# EasyEDA schematic 主板.json
TITLE: Sheet_1; REV: 1.0; Date: 2022-08-09; Sheet: 1/1; Drawn By: ThunderStorm0411; Company: Your Company
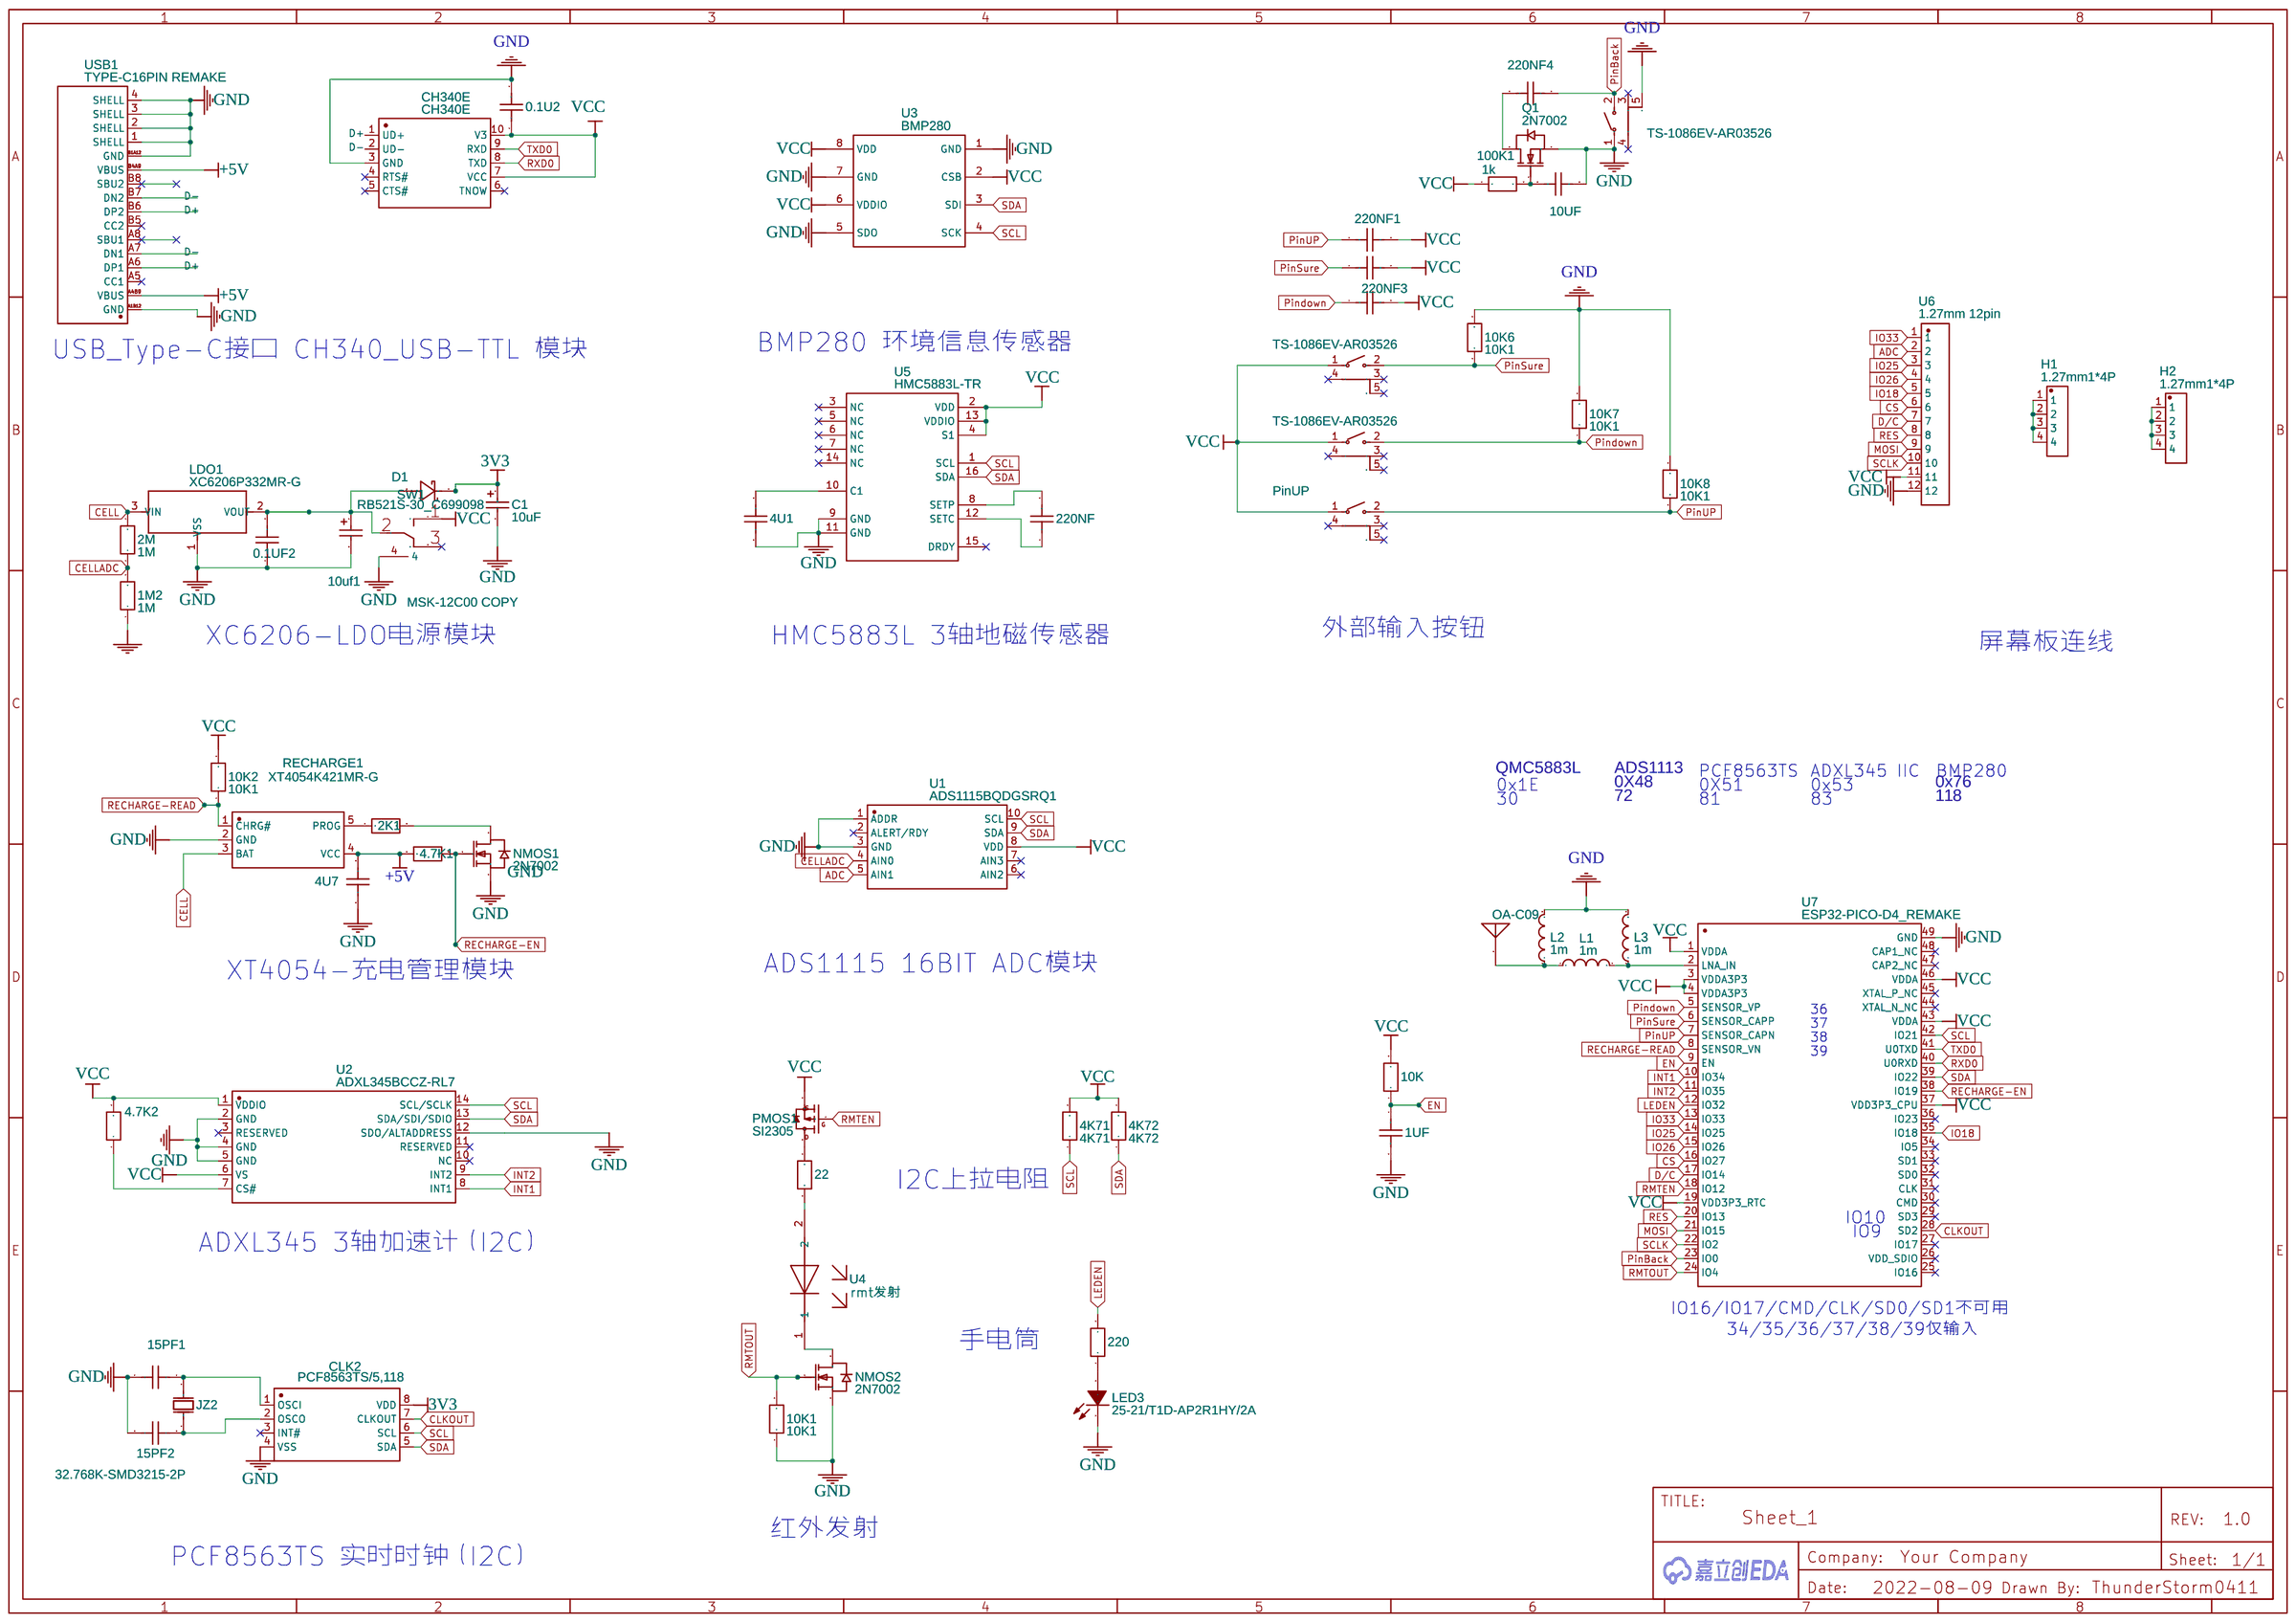
[diagram p0: schematic sheet]

## Parts
0.1U2  0.1u  [C0603]
0.1UF2  0.1u  [C0603]
1  OA-C09  [OA-C09]
1M2  1M  [R0603]
1UF  1uF  [C0603]
2K1  2k1  [R0603]
2M  1M  [R0603]
4.7K1  4.7K  [R0603]
4.7K2  4.7K  [R0603]
4K71  4K71  [R0603]
4K72  4K72  [R0603]
4U1  0.1u  [C0603]
4U7  4.7uf  [C0603]
10K  10kΩ  [R0603]
10K1  10K1  [R0603]
10K2  10K1  [R0603]
10K6  10K1  [R0603]
10K7  10K1  [R0603]
10K8  10K1  [R0603]
10UF  0.1u  [C0603]
15PF1  15PF  [C0603]
15PF2  15PF2  [C0603]
22  1001  [R0603]
100K1  1k  [R0603]
220  10K2  [R0603]
220NF  0.1u  [C0603]
220NF1  0.1u  [C0603]
220NF2  0.1u  [C0603]
220NF3  0.1u  [C0603]
220NF4  0.1u  [C0603]
BACK1  TS-1086EV-AR03526  [SW-SMD_TS-1086EV-AR03526]
C1  10uF  [CAP-SMD_L3.2-W1.6-RD-C7171]
C5  10uf1  [CAP-SMD_L3.2-W1.6-RD-C7171]
CH340E  CH340E  [MSOP-10_L3.0-W3.0-P0.50-LS5.0-BL]
CLK2  PCF8563TS/5,118  [TSSOP-8_L3.0-W3.0-P0.65-LS4.9-BL]
D1  RB521S-30_C699098  [SOD-523_L1.2-W0.8-LS1.6-RD]
DOWN1  TS-1086EV-AR03526  [SW-SMD_TS-1086EV-AR03526]
H1  1.27mm1*4P  [1.27MM1*4P]
H2  1.27mm1*4P  [1.27MM1*4P]
JZ2  32.768K-SMD3215-2P  [CRYSTAL-SMD_L3.2-W1.5-2]
L1  1m  [L0603]
L2  1m  [L0603]
L3  1m  [L0603]
LDO1  XC6206P332MR-G  [SEEED-SOT-23]
LED3  25-21/T1D-AP2R1HY/2A  [LED1206-R-RD]
NMOS1  2N7002  [SOT-23_L2.9-W1.3-P0.95-LS2.4-BR]
NMOS2  2N7002  [SOT-23_L2.9-W1.3-P0.95-LS2.4-BR]
PMOS1  SI2305  [SOT-23-3_L2.9-W1.3-P1.90-LS2.4-BR]
Q1  2N7002  [SOT-23_L2.9-W1.3-P0.95-LS2.4-BR]
RECHARGE1  XT4054K421MR-G  [SOT-23-5_L3.0-W1.7-P0.95-LS2.8-BL]
SURE1  TS-1086EV-AR03526  [SW-SMD_TS-1086EV-AR03526]
SW1  MSK-12C00 COPY  [MSK-12C00]
U1  ADS1115BQDGSRQ1  [VSSOP-10_L3.0-W3.0-P0.50-LS4.9-BL]
U2  ADXL345BCCZ-RL7  [LGA-14_L5.0-W3.0-P0.80-BL]
U3  BMP280  [SENSOR-TH_BMP280-BL]
U4  rmt发射  [RMT发射]
U5  HMC5883L-TR  [LGA-16_L3.0-W3.0-P0.50-BL_SQ]
U6  1.27mm 12pin  [1.27MM 12P]
U7  ESP32-PICO-D4_REMAKE  [ESP32 PICOD4]
UP1  PinUP  [SW-SMD_TS-1086EV-AR03526]
USB1  TYPE-C16PIN REMAKE  [USB-C-SMD_TYPE-C16PIN]

## Library data of the parts
0.1U2 0.1UF2 4U1 4U7 10UF 15PF1 15PF2 220NF 220NF1-220NF4 = C_0603_US: Contributor: LCEDA_Lib
1 = OA-C09: Contributor: Bobbi
1M2 2K1 2M 4.7K1 4K71 4K72 10K1 10K2 10K6-10K8 22 100K1 220 = R_0603_EU: Contributor: LCEDA_Lib
1UF = TMK107BJ105KA-T: Supplier: LCSC; Supplier Part: C92828; Manufacturer: Taiyo Yuden; Contributor: LCSC; JLCPCB Part Class: Extended Part
4.7K2 = SY0603DD30KP: Supplier: LCSC; Supplier Part: C2763744; Manufacturer: SANYEAR(叁叶源); JLCPCB Part Class: Extended Part; Contributor: LCSC
10K = PCAN0603E49R9BST5: Supplier: LCSC; Supplier Part: C2073666; Manufacturer: VISHAY(威世); JLCPCB Part Class: Extended Part; Contributor: LCSC
BACK1 DOWN1 SURE1 UP1 = TS-1086EV-AR03526: Supplier: LCSC; Supplier Part: C720474; Manufacturer: XUNPU; Contributor: LCSC; JLCPCB Part Class: Extended Part
C1 C5 = TAJA106K016RNJ: Supplier: LCSC; Manufacturer: AVX; Supplier Part: C7171; JLCPCB Part Class: Basic Part
CH340E = CH340E: Supplier: LCSC; Manufacturer: WCH; Supplier Part: C99652; JLCPCB Part Class: Extended Part; subpart_no: 1
CLK2 = PCF8563TS/5,118: Supplier: LCSC; Manufacturer: NXP; Supplier Part: C27397; JLCPCB Part Class: Extended Part
D1 = RB521S-30_C699098: Supplier: LCSC; Supplier Part: C699098; Manufacturer: Yangzhou Yangjie Elec Tech; Manufacturer Part: RB521S-30; Contributor: LCSC; JLCPCB Part Class: Extended Part
H1 H2 = 1.27mm1*4P: Supplier Part: C28953; Supplier: LCSC; Manufacturer: ReliaPro; Manufacturer Part: 1.27mm1*12P Straight Headers  Pins; image: http://image.lceda.cn/szlcsc/C28953.jpg; Contributor: CyTech
JZ2 = 32.768K-SMD3215-2P: Supplier: LCSC; Supplier Part: C9900005513; Manufacturer: null; Manufacturer Part: 32.768k-SMD3215-2P; JLCPCB Part Class: Extended Part; Contributor: LCSC
L1-L3 = L0603_US: Contributor: LCEDA_Lib
LDO1 = XC6206P332MR-G: SMD PMIC;LDO;Vin 6V;3.3V;200mA;Without En;1-Ch; sourceId: sIGDBzxv5
LED3 = 25-21/T1D-AP2R1HY/2A: Supplier: LCSC; Manufacturer: EVERLIGHT; Supplier Part: C83915; JLCPCB Part Class: Extended Part
NMOS1 NMOS2 Q1 = 2N7002: Supplier: LCSC; Manufacturer: Nexperia; Manufacturer Part: 2N7002,215; image: //image.lceda.cn/szlcsc/C65189.jpg; Supplier Part: C65189; Paste Type: expand; Contributor: LCEDA_Lib
PMOS1 = SI2305: Supplier: LCSC; Manufacturer: Hottech; Contributor: LCSC; Supplier Part: C181088; JLCPCB Part Class: Extended Part
RECHARGE1 = XT4054K421MR-G: Supplier: LCSC; Manufacturer: NATLINEAR; Contributor: LCSC; Supplier Part: C141405; JLCPCB Part Class: Extended Part
SW1 = MSK-12C00 COPY: Supplier: 英尚微; Contributor: funwun
U1 = ADS1115BQDGSRQ1: Supplier: LCSC; Supplier Part: C2868291; Manufacturer: TI(德州仪器); link: https://atta.szlcsc.comnull; Contributor: lcsc
U2 = ADXL345BCCZ-RL7: Supplier: LCSC; Manufacturer: ADI; Supplier Part: C9667; JLCPCB Part Class: Extended Part
U3 = BMP280: Supplier: LCSC; Manufacturer: Bosch; Supplier Part: C83291; JLCPCB Part Class: Extended Part
U4 = rmt发射: Contributor: ThunderStorm0411
U5 = HMC5883L-TR: Supplier: LCSC; Manufacturer: Honeywell; Supplier Part: C15640; JLCPCB Part Class: Extended Part
U6 = 1.27mm 12pin: Contributor: ThunderStorm0411
U7 = ESP32-PICO-D4_REMAKE: Supplier: LCSC; Supplier Part: C193707; Manufacturer: Espressif Systems; Manufacturer Part: ESP32-PICO-D4; Contributor: LCSC; JLCPCB Part Class: Extended Part
USB1 = TYPE-C16PIN REMAKE: Supplier: LCSC; Supplier Part: C393939; Manufacturer: SHOU HAN; Manufacturer Part: TYPE-C16PIN; Contributor: LCSC; JLCPCB Part Class: Extended Part

## Nets
3V3: C1.1 CLK2.8(VDD) D1.1(K)
+5V: 4.7K1.1 4U7.2 RECHARGE1.4(VCC) USB1.A4B9(VBUS) USB1.B4A9(VBUS)
GND: 0.1U2.2 0.1UF2.1 1M2.1 1UF.2 4U1.1 4U7.1 10K1.1 10K6.2 10K7.2 10K8.2 10UF.2 15PF1.1 15PF2.1 BACK1.1 BACK1.5 C1.2 C5.2 CH340E.3(GND) CLK2.4(VSS) L2.2 L3.2 LDO1.1(VSS) LED3.2(K) NMOS1.2(S) NMOS2.2(S) Q1.2(S) RECHARGE1.2(GND) SW1.4 U1.1(ADDR) U1.3(GND) U2.2(GND) U2.4(GND) U2.5(GND) U2.12(SDO/ALTADDRESS) U3.1(GND) U3.5(SDO) U3.7(GND) U5.9(GND) U5.11(GND) U6.12 U7.49(GND) USB1.1(SHELL) USB1.2(SHELL) USB1.3(SHELL) USB1.4(SHELL) USB1.A1B12(GND) USB1.B1A12(GND)
VCC: 0.1U2.1 4.7K2.2 4K71.2 4K72.2 10K.2 10K2.2 100K1.1 220NF1.2 220NF2.2 220NF3.2 CH340E.7(VCC) CH340E.10(V3) DOWN1.1 PMOS1.2(S) SURE1.1 SW1.1 U1.8(VDD) U2.1(VDDIO) U2.6(VS) U3.2(CSB) U3.6(VDDIO) U3.8(VDD) U5.2(VDD) U5.4(S1) U5.13(VDDIO) U6.11 U7.1(VDDA) U7.3(VDDA3P3) U7.4(VDDA3P3) U7.19(VDD3P3_RTC) U7.37(VDD3P3_CPU) U7.43(VDDA) U7.46(VDDA) UP1.1
ADC: U1.5(AIN1) U6.2
CELL: 2M.2 LDO1.3(VIN) RECHARGE1.3(BAT)
CELLADC: 1M2.2 2M.1 U1.4(AIN0)
CLKOUT: CLK2.7(CLKOUT) U7.28(SD2)
CS: U6.6 U7.16(IO27)
D+: CH340E.1(UD+) USB1.A6(DP1) USB1.B6(DP2)
D-: CH340E.2(UD-) USB1.A7(DN1) USB1.B7(DN2)
D/C: U6.7 U7.17(IO14)
EN: 1UF.1 10K.1 U7.9(EN)
INT1: U2.8(INT1) U7.10(IO34)
INT2: U2.9(INT2) U7.11(IO35)
IO18: U6.5 U7.35(IO18)
IO25: U6.3 U7.14(IO25)
IO26: U6.4 U7.15(IO26)
IO33: U6.1 U7.13(IO33)
LEDEN: 220.2 U7.12(IO32)
MOSI: U6.9 U7.21(IO15)
PinBack: 220NF4.1 BACK1.2 U7.23(IO0)
Pindown: 10K7.1 220NF3.1 DOWN1.2 U7.5(SENSOR_VP)
PinSure: 10K6.1 220NF2.1 SURE1.2 U7.6(SENSOR_CAPP)
PinUP: 10K8.1 220NF1.1 U7.7(SENSOR_CAPN) UP1.2
RECHARGE-EN: 4.7K1.2 NMOS1.1(G) U7.38(IO19)
RECHARGE-READ: 10K2.1 RECHARGE1.1(CHRG#) U7.8(SENSOR_VN)
RES: U6.8 U7.20(IO13)
RMTEN: PMOS1.1(G) U7.18(IO12)
RMTOUT: 10K1.2 NMOS2.1(G) U7.24(IO4)
RXD0: CH340E.8(TXD) U7.40(U0RXD)
SCL: 4K71.1 CLK2.6(SCL) U1.10(SCL) U2.14(SCL/SCLK) U3.4(SCK) U5.1(SCL) U7.42(IO21)
SCLK: U6.10 U7.22(IO2)
SDA: 4K72.1 CLK2.5(SDA) U1.9(SDA) U2.13(SDA/SDI/SDIO) U3.3(SDI) U5.16(SDA) U7.39(IO22)
TXD0: CH340E.9(RXD) U7.41(U0TXD)
Net-(0.1UF2-2): 0.1UF2.2 C5.1 D1.2(A) LDO1.2(VOUT) SW1.2
Net-(1-1): 1.1 L1.1 L2.1
Net-(2K1-1): 2K1.1 RECHARGE1.5(PROG)
Net-(2K1-2): 2K1.2 NMOS1.3(D)
Net-(4.7K2-1): 4.7K2.1 U2.7(CS#)
Net-(4U1-2): 4U1.2 U5.10(C1)
Net-(10UF-1): 10UF.1 100K1.2 Q1.1(G)
Net-(15PF1-2): 15PF1.2 CLK2.1(OSCI) JZ2.2(OSC2)
Net-(15PF2-2): 15PF2.2 CLK2.2(OSCO) JZ2.1(OSC1)
Net-(22-1): 22.1 PMOS1.3(D)
Net-(22-2): 22.2 U4.2
Net-(220-1): 220.1 LED3.1(A)
Net-(220NF4-2): 220NF4.2 Q1.3(D)
Net-(220NF-1): 220NF.1 U5.12(SETC)
Net-(220NF-2): 220NF.2 U5.8(SETP)
Net-(H1-1): H1.1 H1.2 H1.3 H1.4
Net-(H2-1): H2.1 H2.2 H2.3 H2.4
Net-(L1-2): L1.2 L3.1 U7.2(LNA_IN)
Net-(NMOS2-3): NMOS2.3(D) U4.1

Not connected (* = marked no-connect by the designer): BACK1 3* 4*; CH340E 4(RTS#)* 5(CTS#)* 6(TNOW)*; CLK2 3(INT#)*; DOWN1 3* 4* 5*; SURE1 3* 4* 5*; SW1 3*; U1 2(ALERT/RDY)* 6(AIN2)* 7(AIN3)*; U2 3(RESERVED)* 10(NC)* 11(RESERVED)*; U5 3(NC)* 5(NC)* 6(NC)* 7(NC)* 14(NC)* 15(DRDY)*; U7 25(IO16)* 26(VDD_SDIO)* 27(IO17)* 29(SD3)* 30(CMD)* 31(CLK)* 32(SD0)* 33(SD1)* 34(IO5)* 36(IO23)* 44(XTAL_N_NC)* 45(XTAL_P_NC)* 47(CAP2_NC)* 48(CAP1_NC)*; UP1 3* 4* 5*; USB1 A5(CC1)* A8(SBU1)* B5(CC2)* B8(SBU2)*

## Notes on the sheet
- USB_Type-C接口 CH340_USB-TTL 模块
- BMP280 环境信息传感器
- XC6206-LDO电源模块
- HMC5883L 3轴地磁传感器
- 外部输入按钮
- 屏幕板连线
- QMC5883L
- ADS1113
- PCF8563TS
- ADXL345 IIC
- BMP280
- 0x1E
- 0X48
- 0X51
- 0x53
- 0x76
- 30
- 72
- 81
- 83
- 118
- ADS1115 16BIT ADC模块
- XT4054-充电管理模块
- 36
- 37
- 38
- 39
- I2C上拉电阻
- IO10
- ADXL345 3轴加速计（I2C）
- IO9
- IO16/IO17/CMD/CLK/SD0/SD1不可用
- 手电筒
- 34/35/36/37/38/39仅输入
- 红外发射
- PCF8563TS 实时时钟（I2C）
